# EAGLE schematic WS2812B-module (EAGLE 6.6.0)
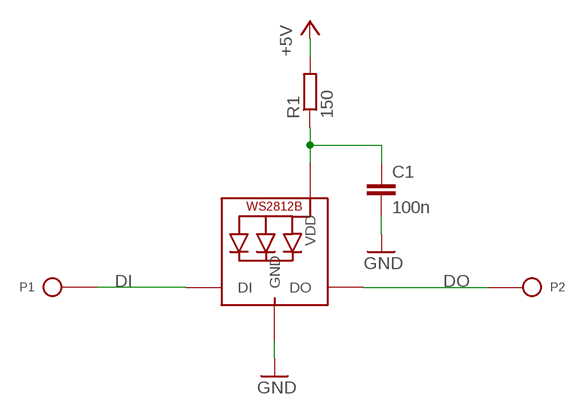
[diagram p0: schematic, sheet 1]

## Parts
C1  100n  C-EUC0805  [C0805]
LED1  WS2812B3535  [LED3535]
P1  RUPAVELIKA  [RUPA2.54]
P2  RUPAVELIKA  [RUPA2.54]
R1  150  R-EU_R0805  [R0805]

## Nets
+5V: R1.2
DI: LED1.1(DI) P1.P$1(P)
DO: LED1.3(DO) P2.P$1(P)
GND: C1.2 LED1.4(GND)
N$1: C1.1 LED1.2(VDD) R1.1

## Library data of the parts
C1 = rcl:C-EU: CAPACITOR, European symbol
LED1 = adafruit:WS2812B
P1 P2 = mylib:RUPA
R1 = rcl:R-EU_: RESISTOR, European symbol